# Altium schematic sheet MCU.SchDoc
size A4
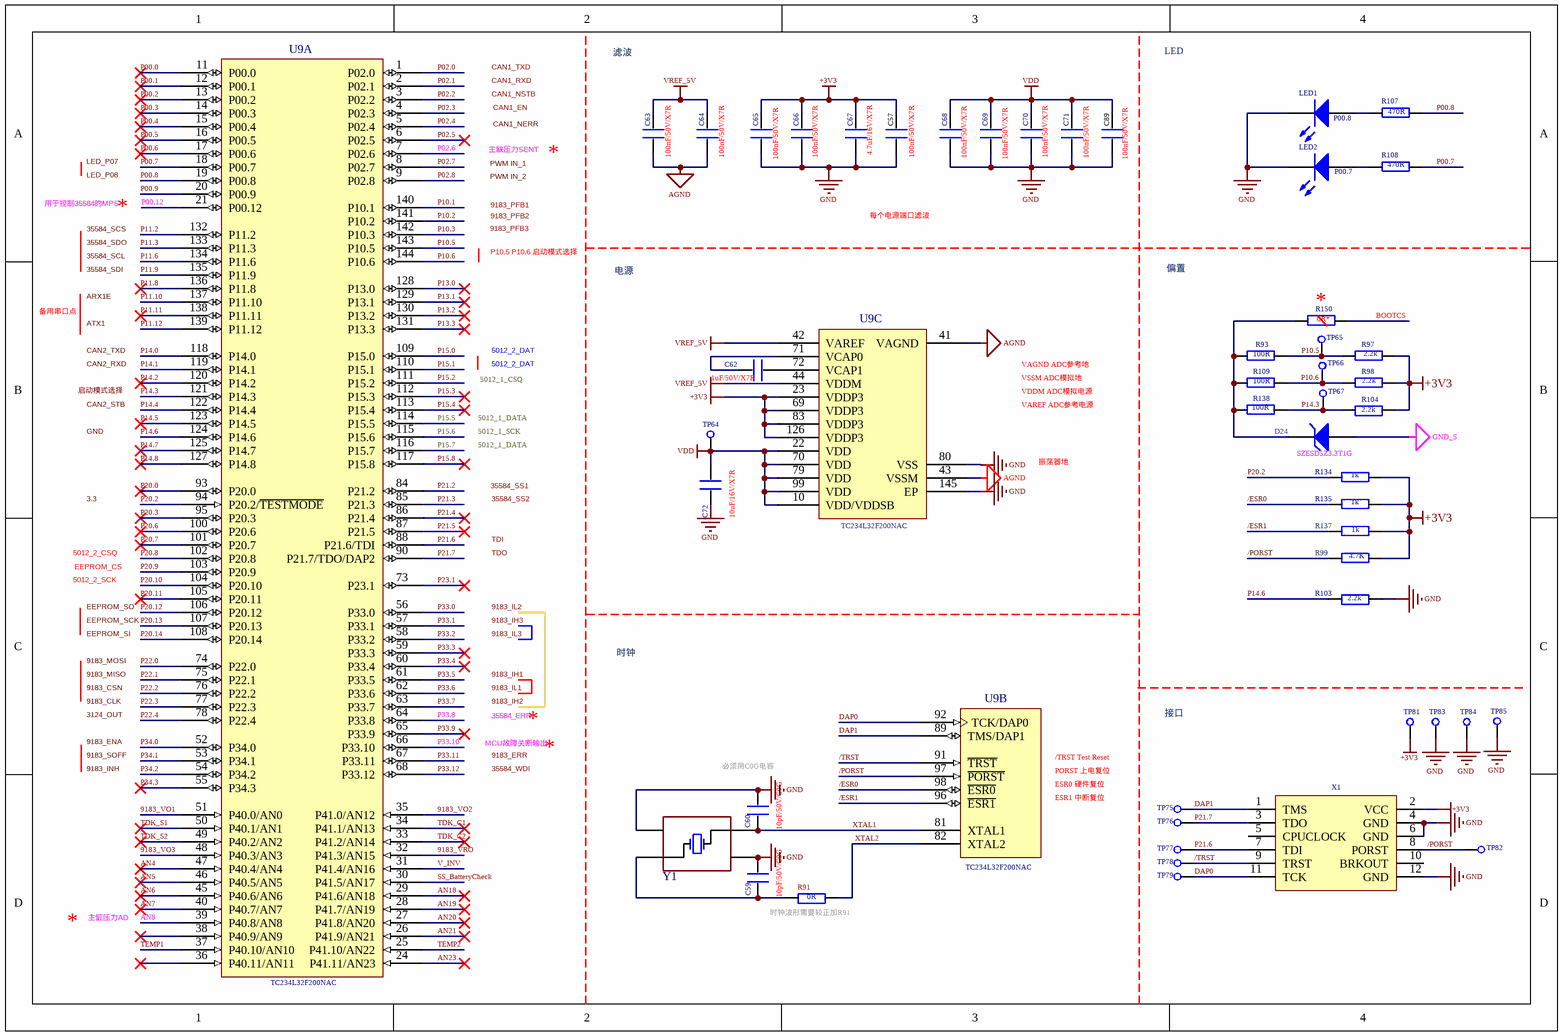
[diagram p0: MCU.SchDoc]

## Parts
C57  100nF/50V/X7R  [C0603P]
C59  10pF/50V/C0G  [C0603P]
C60  10pF/50V/C0G  [C0603P]
C62  1uF/50V/X7R  [C0805]
C63  100nF/50V/X7R  [C0603P]
C64  100nF/50V/X7R  [C0603P]
C65  100nF/50V/X7R  [C0603P]
C66  100nF/50V/X7R  [C0603P]
C67  4.7uF/16V/X7R  [C0805]
C68  100nF/50V/X7R  [C0603P]
C69  100nF/50V/X7R  [C0603P]
C70  100nF/50V/X7R  [C0603P]
C71  100nF/50V/X7R  [C0603P]
C72  10uF/16V/X7R  [C1206]
C89  100nF/50V/X7R  [C0603P]
D24  SZESD5Z3.3T1G  [SOD-523F]
LED1  P00.8  [LED 0805]
LED2  P00.7  [LED 0805]
R91  0R  [0603P]
R93  100R  [0603P]
R97  2.2k  [0603P]
R98  2.2k  [0603P]
R99  4.7K  [0603P]
R103  2.2k  [0603P]
R104  2.2k  [0603P]
R107  470R  [0603P]
R108  470R  [0603P]
R109  100R  [0603P]
R134  1k  [0603P]
R135  1k  [0603P]
R137  1k  [0603P]
R138  100R  [0603P]
R150  0R*  [0603P]
TP64  测试点  [测试点]  (value not drawn)
TP65  测试点  [测试点]  (value not drawn)
TP66  测试点  [测试点]  (value not drawn)
TP67  测试点  [测试点]  (value not drawn)
TP75  测试点  [测试点]  (value not drawn)
TP76  测试点  [测试点]  (value not drawn)
TP77  测试点  [测试点]  (value not drawn)
TP78  测试点  [测试点]  (value not drawn)
TP79  测试点  [测试点]  (value not drawn)
TP81  测试点  [测试点]  (value not drawn)
TP82  测试点  [测试点]  (value not drawn)
TP83  测试点  [测试点]  (value not drawn)
TP84  测试点  [测试点]  (value not drawn)
TP85  测试点  [测试点]  (value not drawn)
U9  TC234L32F200NAC  [INF-PG-TQFP-144-27_7500X7500TP_V]  (parts A,B,C of 3)
X1  12P  [HDR2X6 - duplicate]  (value not drawn)
Y1  晶振  [OSC-SMD_4P-L3.2-W2.5-BL]  (value not drawn)

## Nets
+3V3: C57.1 C65.1 C66.1 C67.2 R97.1 R98.1 R99.1 R104.2 R134.1 R135.1 R137.1 TP81.1 U9.23(VDDP3) U9.69(VDDP3) U9.83(VDDP3) U9.126(VDDP3) X1.2(VCC)
AGND: C63.2 C64.2 U9.41(VAGND) U9.43(VSSM)
GND: C57.2 C59.2 C60.2 C65.2 C66.2 C67.1 C68.2 C69.2 C70.2 C71.2 C72.1 C89.2 LED1.2(K) LED2.2(K) R103.2 TP83.1 TP84.1 TP85.1 U9.80(VSS) U9.145(EP) X1.4(GND) X1.6(GND) X1.12(GND) Y1.2(GND) Y1.4(GND)
GND_S: D24.2(A)
VDD: C68.1 C69.1 C70.1 C71.1 C72.2 C89.1 TP64.1 U9.10(VDD/VDDSB) U9.22(VDD) U9.70(VDD) U9.79(VDD) U9.99(VDD)
VREF_5V: C63.1 C64.1 U9.42(VAREF) U9.44(VDDM)
9183_VO1: U9.51(P40.0/AN0)
9183_VO2: U9.35(P41.0/AN12)
9183_VO3: U9.48(P40.3/AN3)
9183_VRO: U9.32(P41.3/AN15)
/ESR0: R135.2 U9.98(~{ESR0})
/ESR1: R137.2 U9.96(~{ESR1})
/PORST: R99.2 TP82.1 U9.97(~{PORST}) X1.8(PORST)
/TRST: TP78.1 U9.91(~{TRST}) X1.9(TRST)
AN4: U9.47(P40.4/AN4)
AN5: U9.46(P40.5/AN5)
AN6: U9.45(P40.6/AN6)
AN7: U9.40(P40.7/AN7)
AN8: U9.39(P40.8/AN8)
AN18: U9.29(P41.6/AN18)
AN19: U9.28(P41.7/AN19)
AN20: U9.27(P41.8/AN20)
AN21: U9.26(P41.9/AN21)
AN23: U9.24(P41.11/AN23)
BOOTCS: R150.1
DAP0: TP79.1 U9.92(TCK/DAP0) X1.11(TCK)
DAP1: TP75.1 U9.89(TMS/DAP1) X1.1(TMS)
P00.0: U9.11(P00.0)
P00.1: U9.12(P00.1)
P00.2: U9.13(P00.2)
P00.3: U9.14(P00.3)
P00.4: U9.15(P00.4)
P00.5: U9.16(P00.5)
P00.6: U9.17(P00.6)
P00.7: R108.1 U9.18(P00.7)
P00.8: R107.1 U9.19(P00.8)
P00.9: U9.20(P00.9)
P00.12: U9.21(P00.12)
P02.0: U9.1(P02.0)
P02.1: U9.2(P02.1)
P02.2: U9.3(P02.2)
P02.3: U9.4(P02.3)
P02.4: U9.5(P02.4)
P02.5: U9.6(P02.5)
P02.6: U9.7(P02.6)
P02.7: U9.8(P02.7)
P02.8: U9.9(P02.8)
P10.1: U9.140(P10.1)
P10.2: U9.141(P10.2)
P10.3: U9.142(P10.3)
P10.5: R93.1 R97.2 TP65.1 U9.143(P10.5)
P10.6: R98.2 R109.1 TP66.1 U9.144(P10.6)
P11.2: U9.132(P11.2)
P11.3: U9.133(P11.3)
P11.6: U9.134(P11.6)
P11.8: U9.136(P11.8)
P11.9: U9.135(P11.9)
P11.10: U9.137(P11.10)
P11.11: U9.138(P11.11)
P11.12: U9.139(P11.12)
P13.0: U9.128(P13.0)
P13.1: U9.129(P13.1)
P13.2: U9.130(P13.2)
P13.3: U9.131(P13.3)
P14.0: U9.118(P14.0)
P14.1: U9.119(P14.1)
P14.2: U9.120(P14.2)
P14.3: R104.1 R138.1 TP67.1 U9.121(P14.3)
P14.4: U9.122(P14.4)
P14.5: U9.123(P14.5)
P14.6: R103.1 U9.124(P14.6)
P14.7: U9.125(P14.7)
P14.8: U9.127(P14.8)
P15.0: U9.109(P15.0)
P15.1: U9.110(P15.1)
P15.2: U9.111(P15.2)
P15.3: U9.112(P15.3)
P15.4: U9.113(P15.4)
P15.5: U9.114(P15.5)
P15.6: U9.115(P15.6)
P15.7: U9.116(P15.7)
P15.8: U9.117(P15.8)
P20.0: U9.93(P20.0)
P20.2: R134.2 U9.94(P20.2/~{TESTMODE})
P20.3: U9.95(P20.3)
P20.6: U9.100(P20.6)
P20.7: U9.101(P20.7)
P20.8: U9.102(P20.8)
P20.9: U9.103(P20.9)
P20.10: U9.104(P20.10)
P20.11: U9.105(P20.11)
P20.12: U9.106(P20.12)
P20.13: U9.107(P20.13)
P20.14: U9.108(P20.14)
P21.2: U9.84(P21.2)
P21.3: U9.85(P21.3)
P21.4: U9.86(P21.4)
P21.5: U9.87(P21.5)
P21.6: TP77.1 U9.88(P21.6/TDI) X1.7(TDI)
P21.7: TP76.1 U9.90(P21.7/TDO/DAP2) X1.3(TDO)
P22.0: U9.74(P22.0)
P22.1: U9.75(P22.1)
P22.2: U9.76(P22.2)
P22.3: U9.77(P22.3)
P22.4: U9.78(P22.4)
P23.1: U9.73(P23.1)
P33.0: U9.56(P33.0)
P33.1: U9.57(P33.1)
P33.2: U9.58(P33.2)
P33.3: U9.59(P33.3)
P33.4: U9.60(P33.4)
P33.5: U9.61(P33.5)
P33.6: U9.62(P33.6)
P33.7: U9.63(P33.7)
P33.8: U9.64(P33.8)
P33.9: U9.65(P33.9)
P33.10: U9.66(P33.10)
P33.11: U9.67(P33.11)
P33.12: U9.68(P33.12)
P34.0: U9.52(P34.0)
P34.1: U9.53(P34.1)
P34.2: U9.54(P34.2)
P34.3: U9.55(P34.3)
SS_BatteryCheck: U9.30(P41.5/AN17)
TDK_C1: U9.34(P41.1/AN13)
TDK_C2: U9.33(P41.2/AN14)
TDK_S1: U9.50(P40.1/AN1)
TDK_S2: U9.49(P40.2/AN2)
TEMP1: U9.37(P40.10/AN10)
TEMP2: U9.25(P41.10/AN22)
V_INV: U9.31(P41.4/AN16)
XTAL1: C60.1 U9.81(XTAL1) Y1.1(OSC1)
XTAL2: R91.2 U9.82(XTAL2)
NetC59_1: C59.1 R91.1 Y1.3(OSC2)
NetC62_1: C62.1 U9.71(VCAP0)
NetC62_2: C62.2 U9.72(VCAP1)
NetD24_1: D24.1(K) R93.2 R109.2 R138.2 R150.2
NetLED1_1: LED1.1(A) R107.2
NetLED2_1: LED2.1(A) R108.2

Not connected (* = marked no-connect by the designer): U9 36(P40.11/AN11)* 38(P40.9/AN9)*; X1 5(CPUCLOCK) 10(BRKOUT)

## Notes on the sheet
- CAN1_TXD
- CAN1_NSTB
- CAN1_RXD
- CAN1_EN
- 滤波
- LED
- LED_P07
- LED_P08
- 主缺压力SENT
- PWM IN_1
- PWM IN_2
- CAN1_NERR
- *
- 用于控制35584的MPS
- 35584_SCS
- 35584_SDO
- 9183_PFB3
- 9183_PFB2
- 9183_PFB1
- 每个电源端口滤波
- 备用串口点
- 35584_SCL
- 35584_SDI
- ARX1E
- P10.5 P10.6 启动模式选择
- 电源
- 偏置
- (near R150) *
- CAN2_RXD
- CAN2_TXD
- ATX1
- 5012_2_DAT
- VSSM ADC模拟地
- VAGND ADC参考地
- 启动模式选择
- CAN2_STB
- GND
- VDDM ADC模拟电源
- VAREF ADC参考电源
- 3.3
- 35584_SS1
- 35584_SS2
- 振荡器地
- 5012_2_CSQ
- 5012_2_SCK
- EEPROM_CS
- TDI
- TDO
- EEPROM_SI
- EEPROM_SO
- EEPROM_SCK
- 9183_IL2
- 9183_IH3
- 9183_IL3
- 时钟
- 3124_OUT
- 9183_CLK
- 9183_CSN
- 9183_MISO
- 9183_MOSI
- 35584_ERR
- 9183_IL1
- 9183_IH1
- 9183_IH2
- 接口
- 9183_INH
- 9183_ENA
- 9183_SOFF
- MCU故障关断输出
- 9183_ERR
- 35584_WDI
- (near C60) 必须用C0G电容
- PORST 上电复位
- ESR0 硬件复位
- /TRST Test Reset
- ESR1 中断复位
- 主缸压力AD
- (near R91) 时钟波形需要较正加R91
- Labels drawn without touching a wire or pin: 5012_1_CSQ, 5012_1_DATA, 5012_1_SCK

## Library data of the parts
C57 C59 C60 C62-C72 C89 = C
D24 = D Zener: Zener Diode; Published: 8-Jun-2000; LatestRevisionDate: 17-Jul-2002; LatestRevisionNote: Re-released for DXP Platform.; PackageReference: DIODE-0.7; Publisher: Altium Limited; PackageDescription: Diode, Thru-Hole; 2 Leads; 0.7 in Pin Spacing
LED1 LED2 = LED2: Typical RED, GREEN, YELLOW, AMBER GaAs LED; Published: 8-Jun-2000; LatestRevisionDate: 17-Jul-2002; LatestRevisionNote: Re-released for DXP Platform.; PackageDocument: Feb-2002; PackageReference: 3.2X1.6X1.1; Publisher: Altium Limited
R91 R93 R97-R99 R103 R104 R107-R109 R134 R135 R137 R138 R150 = R
U9 = SAK-TC234LA-32F200F AB: 32-bit multi-core TriCore AURIX microcontroller with 736 KB SRAM, 2 MB Flash, 200 MHz Frequency, -40 to 125 degC, PG-TQFP-144; Manufacturer: Infineon; ADC Chan.: 24; Core 0 TC16E DSPR (KB): 184; Core 0 TC16E PSPR (KB): 8; DFLASH (KB@cycles): 128@125k; ETH: Yes; Flash (MB): 2; FlexRay (#/ch.): 1 / 2; Freq. (MHz): 200; LMU (KB): 32; Total SRAM (KB): 736; DatasheetVersion: Rev. 1.1; PackageReference: PG-TQFP-144-27_LX; PackageDescription: 144-Pin Plastic (Green) Thin Quad Flat Package, 16 x 16 mm Body, 0.4 mm Pitch; Supplier 1: Mouser; Supplier Part Number 1: 726-TC234LA32F200FAB; FFT: Yes; HSM: Yes; Derivative: SAK-TC234LA-32F200F AB; Supplier Part Reference: TC234LA32F200FABKXUMA1; Mounting Technology: Surface Mount; PartNumber: SAK-TC234LA-32F200F AB; ComponentLink1Description: Manufacturer URL; ComponentLink1URL: http://www.infineon.com/